# Altium schematic sheet STM32L_144.SchDoc: MCU
size A3; DocumentNumber: MB1312; Revision: A-01; SheetNumber: 2; SheetTotal: 6; Project: NUCLEO-LXXXZX
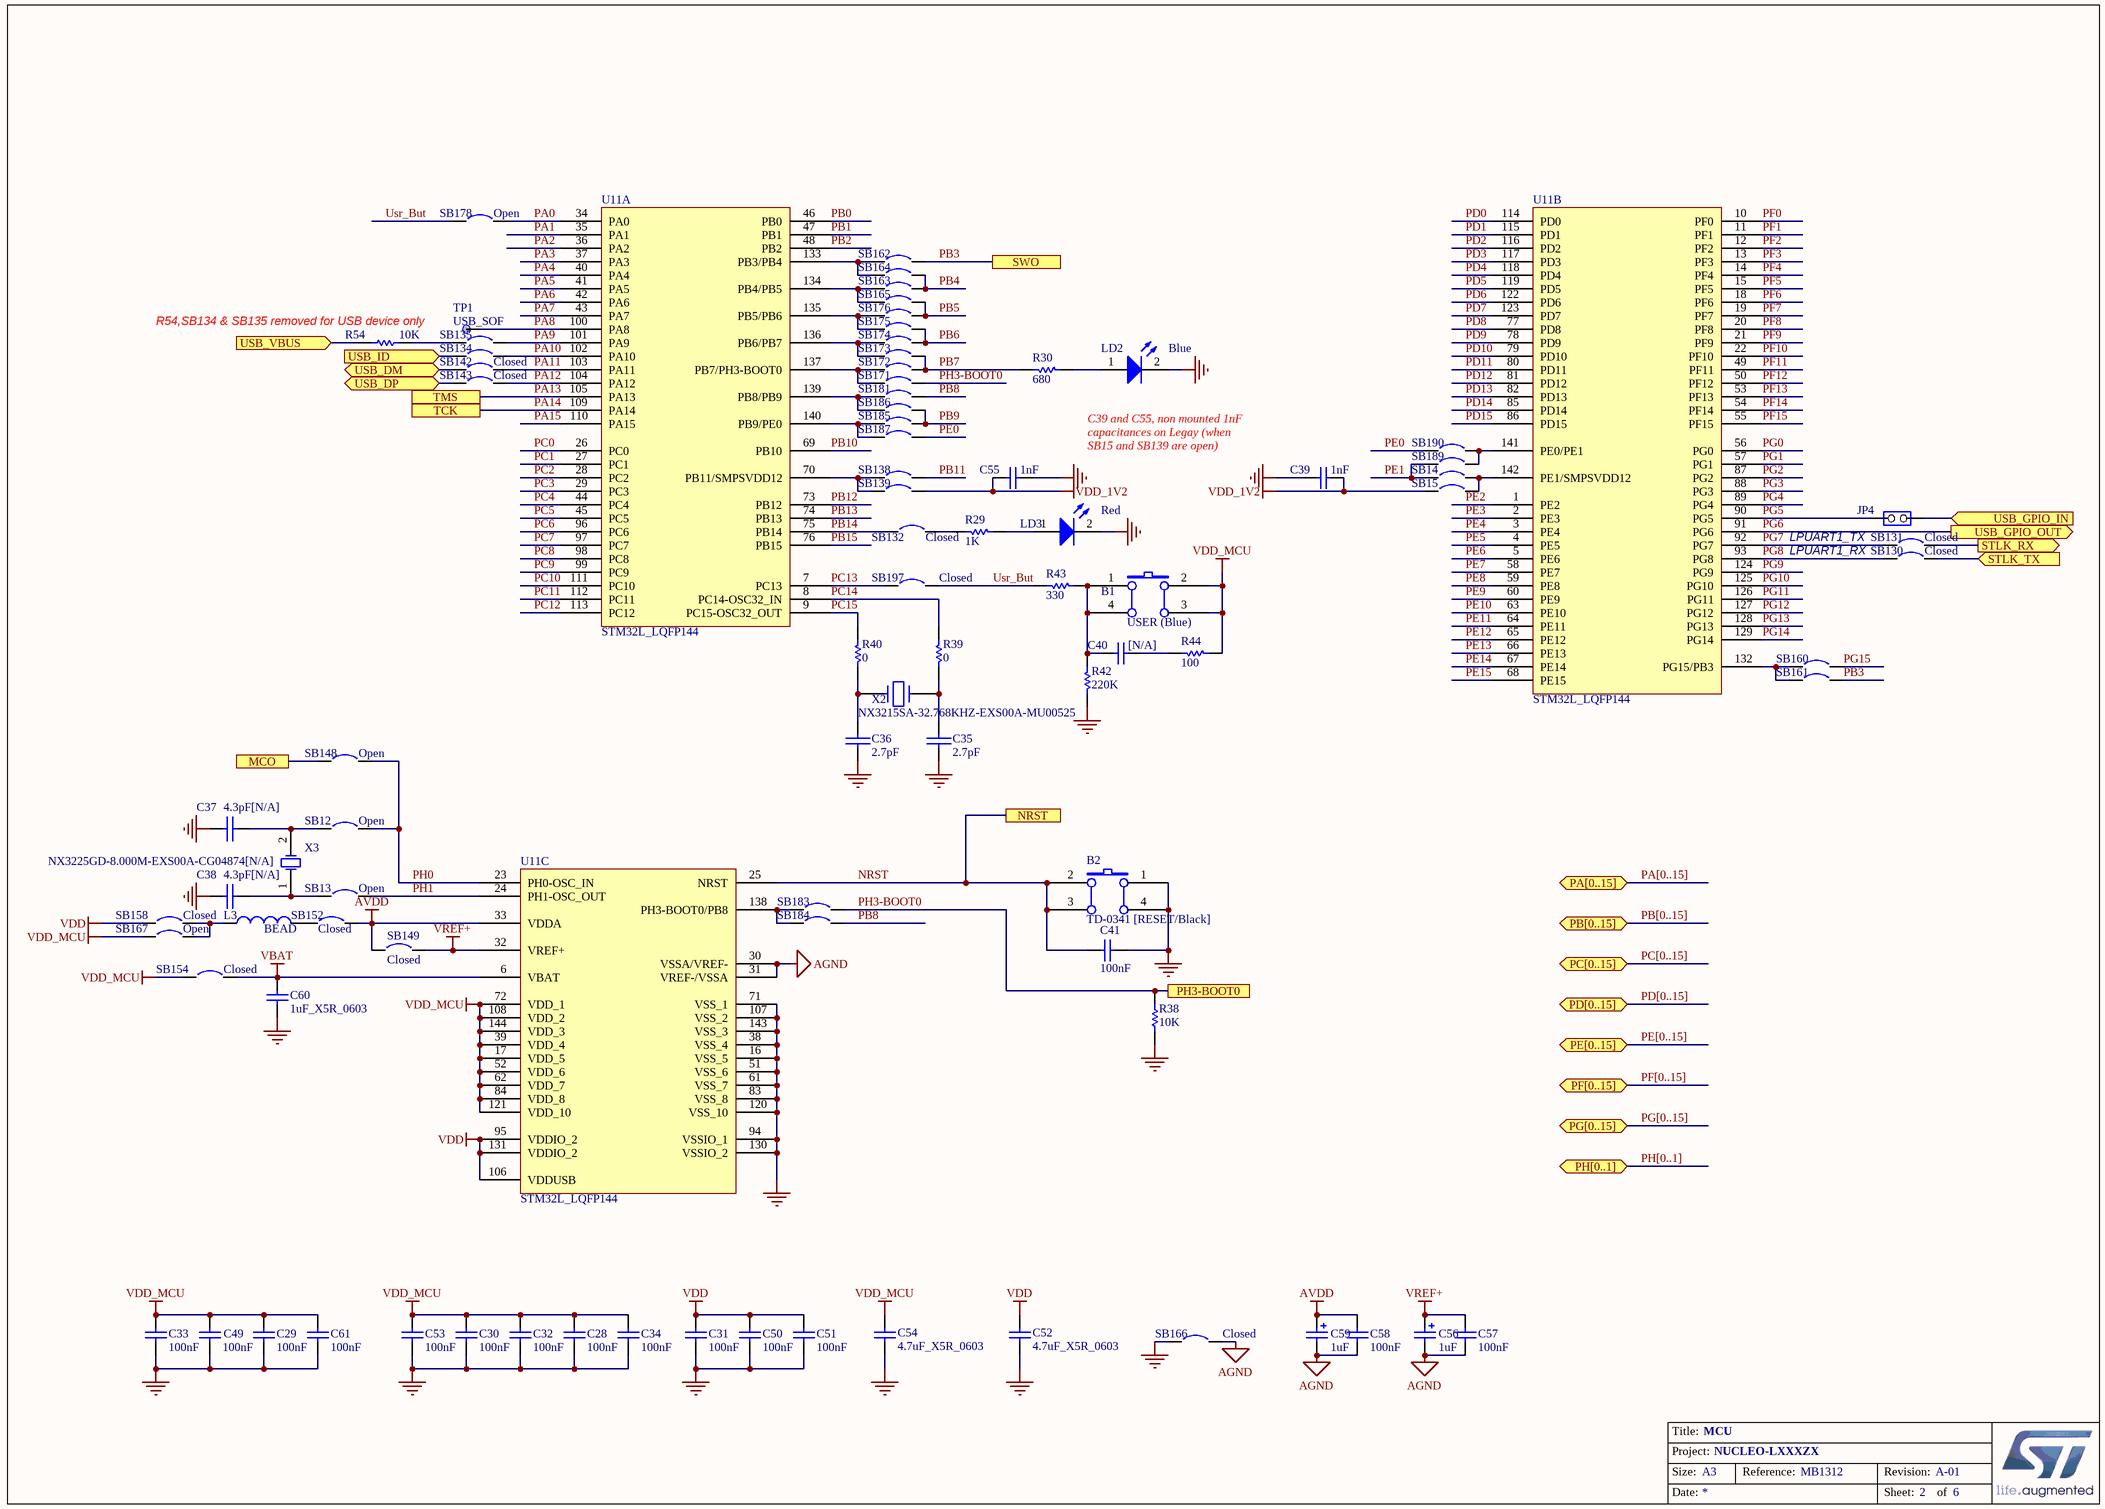
[diagram p0: STM32L_144.SchDoc]

## Parts
B1  USER (Blue)  [PB-6X6mm-Blue]
B2  TD-0341 [RESET/Black]  [PB-6X6mm-Black]
C28  100nF  [0603C]
C29  100nF  [0603C]
C30  100nF  [0603C]
C31  100nF  [0603C]
C32  100nF  [0603C]
C33  100nF  [0603C]
C34  100nF  [0603C]
C35  2.7pF  [0603C]
C36  2.7pF  [0603C]
C37  4.3pF[N/A]  [0603C]
C38  4.3pF[N/A]  [0603C]
C39  1nF  [0603C]
C40  [N/A]  [0603C]
C41  100nF  [0603C]
C49  100nF  [0603C]
C50  100nF  [0603C]
C51  100nF  [0603C]
C52  4.7uF_X5R_0603  [0603C]
C53  100nF  [0603C]
C54  4.7uF_X5R_0603  [0603C]
C55  1nF  [0603C]
C56  value 1uF  [TAN-A]  (hidden comment: TAJA105K016R)
C57  100nF  [0603C]
C58  100nF  [0603C]
C59  value 1uF  [TAN-A]  (hidden comment: TAJA105K016R)
C60  1uF_X5R_0603  [0603C]
C61  100nF  [0603C]
JP4  (no value)  [HDR_1x2_2R54_V_M_S]
L3  BEAD  [0603L]
LD2  Blue  [0603D-B]
LD3  Red  [0603D-R]
R29  1K  [0603R]
R30  680  [0603R]
R38  10K  [0603R]
R39  0  [0603R]
R40  0  [0603R]
R42  220K  [0603R]
R43  330  [0603R]
R44  100  [0603R]
R54  10K  [0603R]
SB12  Open  [SB_0603]
SB13  Open  [SB_0603]
SB14  Circuit Breaker  [SB_0603]  (value not drawn)
SB15  Circuit Breaker  [SB_0603]  (value not drawn)
SB130  Closed  [SB_0603]
SB131  Closed  [SB_0603]
SB132  Closed  [SB_0603]
SB134  Circuit Breaker  [SB_0603]  (value not drawn)
SB135  Circuit Breaker  [SB_0603]  (value not drawn)
SB138  Circuit Breaker  [SB_0603]  (value not drawn)
SB139  Circuit Breaker  [SB_0603]  (value not drawn)
SB142  Closed  [SB_0603]
SB143  Closed  [SB_0603]
SB148  Open  [SB_0603]
SB149  Closed  [SB_0603]
SB152  Closed  [SB_0603]
SB154  Closed  [SB_0603]
SB158  Closed  [SB_0603]
SB160  Circuit Breaker  [SB_0603]  (value not drawn)
SB161  Circuit Breaker  [SB_0603]  (value not drawn)
SB162  Circuit Breaker  [SB_0603]  (value not drawn)
SB163  Circuit Breaker  [SB_0603]  (value not drawn)
SB164  Circuit Breaker  [SB_0603]  (value not drawn)
SB165  Circuit Breaker  [SB_0603]  (value not drawn)
SB166  Closed  [SB_0603]
SB167  Open  [SB_0603]
SB171  Circuit Breaker  [SB_0603]  (value not drawn)
SB172  Circuit Breaker  [SB_0603]  (value not drawn)
SB173  Circuit Breaker  [SB_0603]  (value not drawn)
SB174  Circuit Breaker  [SB_0603]  (value not drawn)
SB175  Circuit Breaker  [SB_0603]  (value not drawn)
SB176  Circuit Breaker  [SB_0603]  (value not drawn)
SB178  Open  [SB_0603]
SB181  Circuit Breaker  [SB_0603]  (value not drawn)
SB183  Circuit Breaker  [SB_0603]  (value not drawn)
SB184  Circuit Breaker  [SB_0603]  (value not drawn)
SB185  Circuit Breaker  [SB_0603]  (value not drawn)
SB186  Circuit Breaker  [SB_0603]  (value not drawn)
SB187  Circuit Breaker  [SB_0603]  (value not drawn)
SB189  Circuit Breaker  [SB_0603]  (value not drawn)
SB190  Circuit Breaker  [SB_0603]  (value not drawn)
SB197  Closed  [SB_0603]
TP1  USB_SOF  [TP]
U11  STM32L_LQFP144  [LQFP144_0R5_SKT]  (parts A,B,C of 3)
X2  NX3215SA-32.768KHZ-EXS00A-MU00525  [XTAL_2SM_3R2X1R5]
X3  NX3225GD-8.000M-EXS00A-CG04874[N/A]  [OSC_2SM_3R2x2R5]

## Ports
MCO, NRST, PA[0..15] (bidir), PB[0..15] (bidir), PC[0..15] (bidir), PD[0..15] (bidir), PE[0..15] (bidir), PF[0..15] (bidir), PG[0..15] (bidir), PH3-BOOT0, PH[0..1] (bidir), STLK_RX (out), STLK_TX (in), SWO, TCK, TMS, USB_DM (bidir), USB_DP (bidir), USB_GPIO_IN (in), USB_GPIO_OUT (out), USB_ID (in), USB_VBUS (in)

## Nets
AGND: C56.2 C57.2 C58.2 C59.2 SB166.2 U11.30(VSSA/VREF-) U11.31(VREF-/VSSA)
AVDD: C58.1 C59.1 SB149.1 SB152.2 U11.33(VDDA)
GND: B2.1(A0) B2.4(A1) C28.2 C29.2 C30.2 C31.2 C32.2 C33.2 C34.2 C35.2 C36.2 C37.2 C38.2 C39.1 C41.1 C49.2 C50.2 C51.2 C52.2 C53.2 C54.2 C55.1 C60.2 C61.2 LD2.2(K) LD3.2(K) R38.2 R42.2 SB166.1 U11.16(VSS_5) U11.38(VSS_4) U11.51(VSS_6) U11.61(VSS_7) U11.71(VSS_1) U11.83(VSS_8) U11.94(VSSIO_1) U11.107(VSS_2) U11.120(VSS_10) U11.130(VSSIO_2) U11.143(VSS_3)
VBAT: C60.1 SB154.2 U11.6(VBAT)
VDD: C31.1 C50.1 C51.1 C52.1 SB158.1 U11.95(VDDIO_2) U11.106(VDDUSB) U11.131(VDDIO_2)
VDD_1V2: C39.2 C55.2 SB15.2 SB139.2
VDD_MCU: B1.2(B0) B1.3(B1) C28.1 C29.1 C30.1 C32.1 C33.1 C34.1 C49.1 C53.1 C54.1 C61.1 R44.1 SB154.1 SB167.1 U11.17(VDD_5) U11.39(VDD_4) U11.52(VDD_6) U11.62(VDD_7) U11.72(VDD_1) U11.84(VDD_8) U11.108(VDD_2) U11.121(VDD_10) U11.144(VDD_3)
VREF+: C56.1 C57.1 SB149.2 U11.32(VREF+)
MCO: SB148.2 ; port MCO
NRST: B2.2(B0) B2.3(B1) C41.2 U11.25(NRST) ; port NRST
PA0: SB178.2 U11.34(PA0)
PA1: U11.35(PA1)
PA2: U11.36(PA2)
PA3: U11.37(PA3)
PA4: U11.40(PA4)
PA5: U11.41(PA5)
PA6: U11.42(PA6)
PA7: U11.43(PA7)
PA8: TP1.1 U11.100(PA8)
PA9: SB135.2 U11.101(PA9)
PA10: SB134.2 U11.102(PA10)
PA11: SB142.2 U11.103(PA11)
PA12: SB143.2 U11.104(PA12)
PA13: U11.105(PA13) ; port TMS
PA14: U11.109(PA14) ; port TCK
PA15: U11.110(PA15)
PB0: U11.46(PB0)
PB1: U11.47(PB1)
PB2: U11.48(PB2)
PB3: SB161.2 SB162.2 ; port SWO
PB4: SB163.2 SB164.2
PB5: SB165.2 SB176.2
PB6: SB174.2 SB175.2
PB7: R30.1 SB172.2 SB173.2
PB8: SB181.2 SB184.2
PB9: SB185.2 SB186.2
PB10: U11.69(PB10)
PB11: SB138.2
PB12: U11.73(PB12)
PB13: U11.74(PB13)
PB14: SB132.1 U11.75(PB14)
PB15: U11.76(PB15)
PC0: U11.26(PC0)
PC1: U11.27(PC1)
PC2: U11.28(PC2)
PC3: U11.29(PC3)
PC4: U11.44(PC4)
PC5: U11.45(PC5)
PC6: U11.96(PC6)
PC7: U11.97(PC7)
PC8: U11.98(PC8)
PC9: U11.99(PC9)
PC10: U11.111(PC10)
PC11: U11.112(PC11)
PC12: U11.113(PC12)
PC13: SB197.1 U11.7(PC13)
PC14: R39.2 U11.8(PC14-OSC32_IN)
PC15: R40.2 U11.9(PC15-OSC32_OUT)
PD0: U11.114(PD0)
PD1: U11.115(PD1)
PD2: U11.116(PD2)
PD3: U11.117(PD3)
PD4: U11.118(PD4)
PD5: U11.119(PD5)
PD6: U11.122(PD6)
PD7: U11.123(PD7)
PD8: U11.77(PD8)
PD9: U11.78(PD9)
PD10: U11.79(PD10)
PD11: U11.80(PD11)
PD12: U11.81(PD12)
PD13: U11.82(PD13)
PD14: U11.85(PD14)
PD15: U11.86(PD15)
PE0: SB187.2 SB190.1
PE1: SB14.1 SB189.1
PE2: U11.1(PE2)
PE3: U11.2(PE3)
PE4: U11.3(PE4)
PE5: U11.4(PE5)
PE6: U11.5(PE6)
PE7: U11.58(PE7)
PE8: U11.59(PE8)
PE9: U11.60(PE9)
PE10: U11.63(PE10)
PE11: U11.64(PE11)
PE12: U11.65(PE12)
PE13: U11.66(PE13)
PE14: U11.67(PE14)
PE15: U11.68(PE15)
PF0: U11.10(PF0)
PF1: U11.11(PF1)
PF2: U11.12(PF2)
PF3: U11.13(PF3)
PF4: U11.14(PF4)
PF5: U11.15(PF5)
PF6: U11.18(PF6)
PF7: U11.19(PF7)
PF8: U11.20(PF8)
PF9: U11.21(PF9)
PF10: U11.22(PF10)
PF11: U11.49(PF11)
PF12: U11.50(PF12)
PF13: U11.53(PF13)
PF14: U11.54(PF14)
PF15: U11.55(PF15)
PG0: U11.56(PG0)
PG1: U11.57(PG1)
PG2: U11.87(PG2)
PG3: U11.88(PG3)
PG4: U11.89(PG4)
PG5: JP4.2(NO) U11.90(PG5)
PG6: U11.91(PG6) ; port USB_GPIO_OUT
PG7: SB131.1 U11.92(PG7)
PG8: SB130.1 U11.93(PG8)
PG9: U11.124(PG9)
PG10: U11.125(PG10)
PG11: U11.126(PG11)
PG12: U11.127(PG12)
PG13: U11.128(PG13)
PG14: U11.129(PG14)
PG15: SB160.2
PH0: SB12.2 SB148.1 U11.23(PH0-OSC_IN)
PH1: SB13.2 U11.24(PH1-OSC_OUT)
PH3-BOOT0: R38.1 SB171.2 SB183.2 ; port PH3-BOOT0
STLK_RX: SB131.2 ; port STLK_RX
STLK_TX: SB130.2 ; port STLK_TX
USB_DM: SB142.1 ; port USB_DM
USB_DP: SB143.1 ; port USB_DP
USB_GPIO_IN: JP4.1(COMMON) ; port USB_GPIO_IN
USB_ID: SB134.1 ; port USB_ID
USB_VBUS: R54.1 ; port USB_VBUS
Usr_But: R43.2 SB178.1 SB197.2
NetB1_1: B1.1(A0) B1.4(A1) C40.2 R42.1 R43.1
NetC35_1: C35.1 R39.1 X2.2
NetC36_1: C36.1 R40.1 X2.1
NetC37_1: C37.1 SB12.1 X3.2(OSC2)
NetC38_1: C38.1 SB13.1 X3.1(OSC1)
NetC40_1: C40.1 R44.2
NetL3_1: L3.1 SB158.2 SB167.2
NetL3_2: L3.2 SB152.1
NetLD2_1: LD2.1(A) R30.2
NetLD3_1: LD3.1(A) R29.2
NetR29_1: R29.1 SB132.2
NetR54_2: R54.2 SB135.1
NetSB14_2: SB14.2 SB15.1 U11.142(PE1/SMPSVDD12)
NetSB138_1: SB138.1 SB139.1 U11.70(PB11/SMPSVDD12)
NetSB160_1: SB160.1 SB161.1 U11.132(PG15/PB3)
NetSB162_1: SB162.1 SB164.1 U11.133(PB3/PB4)
NetSB163_1: SB163.1 SB165.1 U11.134(PB4/PB5)
NetSB171_1: SB171.1 SB172.1 U11.137(PB7/PH3-BOOT0)
NetSB173_1: SB173.1 SB174.1 U11.136(PB6/PB7)
NetSB175_1: SB175.1 SB176.1 U11.135(PB5/PB6)
NetSB181_1: SB181.1 SB186.1 U11.139(PB8/PB9)
NetSB183_1: SB183.1 SB184.1 U11.138(PH3-BOOT0/PB8)
NetSB185_1: SB185.1 SB187.1 U11.140(PB9/PE0)
NetSB189_2: SB189.2 SB190.2 U11.141(PE0/PE1)

## Buses and harness runs
bus PA[0..15] = port PA[0..15]
bus PB[0..15] = port PB[0..15]
bus PC[0..15] = port PC[0..15]
bus PD[0..15] = port PD[0..15]
bus PE[0..15] = port PE[0..15]
bus PF[0..15] = port PF[0..15]
bus PG[0..15] = port PG[0..15]
bus PH[0..1] = port PH[0..1]

## Notes on the sheet
- (near R54) R54,SB134 & SB135 removed for USB device only
- C39 and C55, non mounted 1nF capacitances on Legay (when SB15 and SB139 are open)
- LPUART1_TX
- LPUART1_RX
- Title:
- Project:
- Size:
- Date:
- A3
- Reference:
- Sheet:
- Revision:
- of

## Library data of the parts
B1 B2 = SW PUSHBUTTON: SE PUSHBUTTON
C28-C34 C39 C49-C51 C53 C55 C57 C58 C61 = Cap: Capacitor; Value: 10nF; Published: 8-Jun-2000; Revision: July-2002: Re-released for DXP Platform.; Publisher: Altium Limited
C35-C38 = CAP: Capacitor
C40 C41 = CAP: Capacitor; Value: 100pF; Published: 8-Jun-2000; Revision: July-2002: Re-released for DXP Platform.; Publisher: Altium Limited
C52 C54 = CAP SMD 0603  X5R 1µF 25V 10%: 0603  X5R 4.7uF; Value: 1µF; Rated voltage: 25V; Tolerance: 10%; Manufacturer: *; Manufacturer P/N: *; Order code Farnell: 1288202RL; Power: *; Technology: X5R; Temperature  Factor: *; Temperature Max: +125°C; Temperature Min: -55°C; STS Code: *
C56 C59 = Cap Pol1: Tan Capacitor,1uF,10%,16V,Tan-A,TAJA105K016R; Manuf_1: AVX; Ordered by: Subcon; ECCN_US/EU: NA; Published: 8-Jun-2000; Revision: July-2002: Re-released for DXP Platform.; Publisher: Altium Limited; Manuf_Part_1: TAJA105K016R
C60 = CAP SMD 0603  X5R 1µF 25V 10%: 0603  X5R 1µF; Rated voltage: 25V; Tolerance: 10%; Manufacturer: *; Manufacturer P/N: *; Order code Farnell: 1288202RL; Value: 1µF; Power: *; Technology: X5R; Temperature  Factor: *; Temperature Max: +125°C; Temperature Min: -55°C; STS Code: *
JP4 = JP2
L3 = Inductor: Value: 100uH; Published: 8-Jun-2000; Revision: July-2002: Re-released for DXP Platform.; Publisher: Altium Limited
LD2 LD3 = LED2: Typical RED, GREEN, YELLOW, AMBER GaAs LED; Published: 8-Jun-2000; Revision: July-2002: Re-released for DXP Platform.; Publisher: Altium Limited
R29 = Res1: Resistor; Published: 8-Jun-2000; Revision: July-2002: Re-released for DXP Platform.; Publisher: Altium Limited; Value: 1K
R30 R39 R40 R43 R44 = Res1: Resistor; Value: 1K; Published: 8-Jun-2000; Revision: July-2002: Re-released for DXP Platform.; Publisher: Altium Limited
R38 R42 = res1: Resistor; Value: 1K; Published: 8-Jun-2000; Revision: July-2002: Re-released for DXP Platform.; Publisher: Altium Limited
R54 = Resistor_ST: Resistor 0402 / 0603 / 0805; Value: 10K
SB12 SB13 SB148 SB167 SB178 = Circuit Breaker: Published: 24-Mar-1999; Revision: July-2002: Re-released for DXP Platform.; Publisher: Altium Limited
SB14 SB15 SB134 SB135 SB138 SB139 SB160-SB165 SB171-SB176 SB181 SB183-SB187 SB189 SB190 = Circuit Breaker: Solder: NO; Published: 24-Mar-1999; Revision: July-2002: Re-released for DXP Platform.; Publisher: Altium Limited
SB130-SB132 SB142 SB143 SB149 SB152 SB154 SB158 SB166 SB197 = Circuit Breaker_close: Circuit Breaker; Published: 24-Mar-1999; Revision: July-2002: Re-released for DXP Platform.; Publisher: Altium Limited
TP1 = TP
X2 = CRYSTAL_32K: Crystal
X3 = XTAL: Crystal Oscillator; Published: 8-Jun-2000; LatestRevisionDate: 17-Jul-2002; LatestRevisionNote: Re-released for DXP Platform.; PackageReference: R38; Publisher: Altium Limited